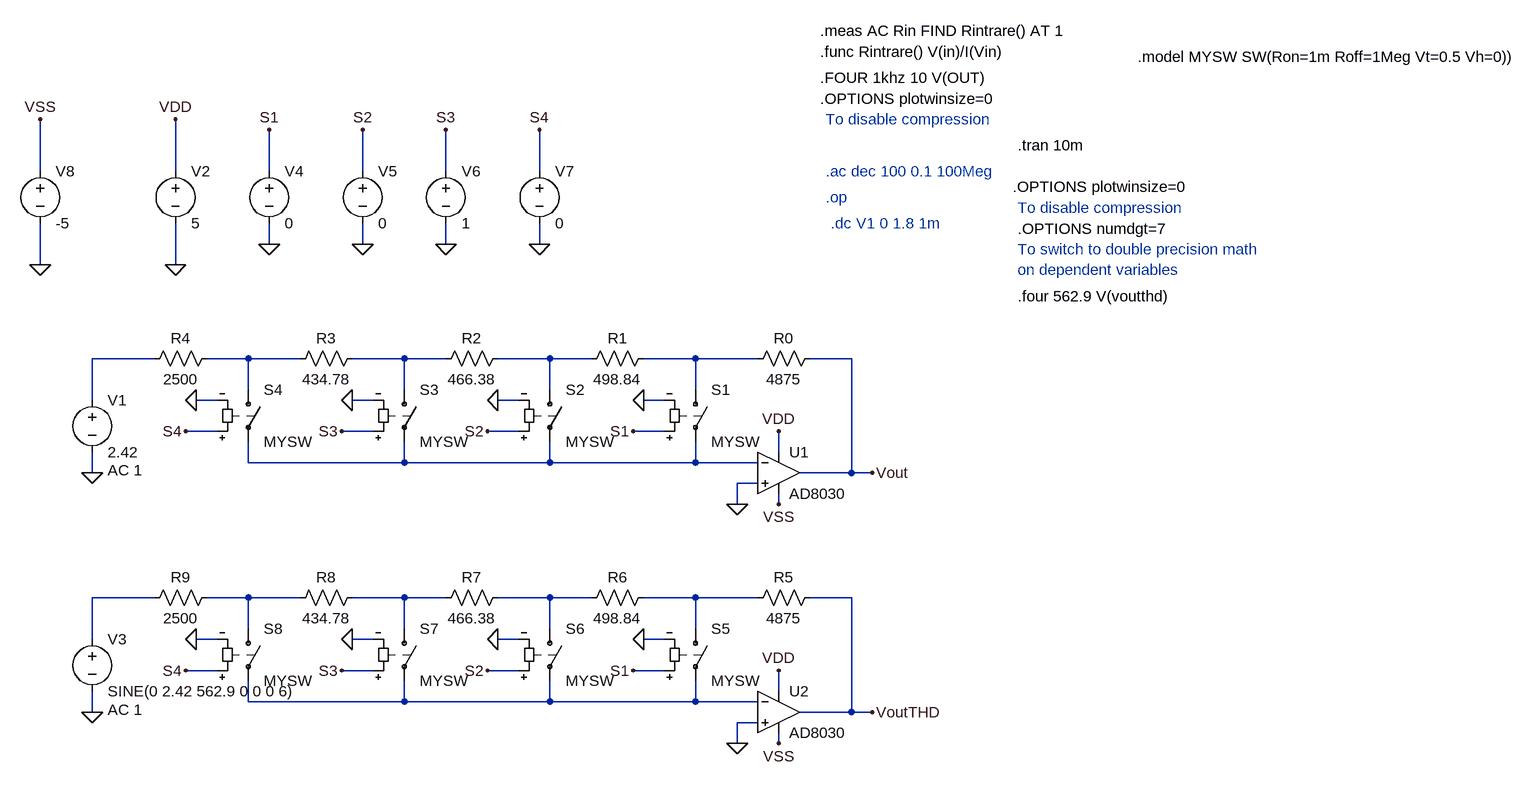
[diagram p0: schematic Stage3.asc]
Stage3.asc, the LTspice schematic file:
Version 4
SHEET 1 1820 2436
WIRE -1360 -240 -1360 -320
WIRE -1152 -240 -1152 -320
WIRE -1008 -240 -1008 -304
WIRE -864 -240 -864 -304
WIRE -736 -240 -736 -304
WIRE -592 -240 -592 -304
WIRE -1008 -128 -1008 -160
WIRE -864 -128 -864 -160
WIRE -736 -128 -736 -160
WIRE -592 -128 -592 -160
WIRE -1360 -96 -1360 -160
WIRE -1152 -96 -1152 -160
WIRE -1184 48 -1280 48
WIRE -1040 48 -1104 48
WIRE -960 48 -1040 48
WIRE -800 48 -880 48
WIRE -736 48 -800 48
WIRE -576 48 -656 48
WIRE -512 48 -576 48
WIRE -352 48 -432 48
WIRE -256 48 -352 48
WIRE -112 48 -176 48
WIRE -1040 96 -1040 48
WIRE -800 96 -800 48
WIRE -576 96 -576 48
WIRE -352 96 -352 48
WIRE -1280 112 -1280 48
WIRE -1088 112 -1120 112
WIRE -848 112 -880 112
WIRE -624 112 -656 112
WIRE -400 112 -432 112
WIRE -1088 160 -1136 160
WIRE -848 160 -896 160
WIRE -624 160 -672 160
WIRE -400 160 -448 160
WIRE -224 192 -224 160
WIRE -1040 208 -1040 176
WIRE -800 208 -800 176
WIRE -800 208 -1040 208
WIRE -576 208 -576 176
WIRE -576 208 -800 208
WIRE -352 208 -352 176
WIRE -352 208 -576 208
WIRE -256 208 -352 208
WIRE -1280 224 -1280 192
WIRE -112 224 -112 48
WIRE -112 224 -192 224
WIRE -80 224 -112 224
WIRE -256 240 -288 240
WIRE -288 272 -288 240
WIRE -224 272 -224 256
WIRE -1184 416 -1280 416
WIRE -1040 416 -1104 416
WIRE -960 416 -1040 416
WIRE -800 416 -880 416
WIRE -736 416 -800 416
WIRE -576 416 -656 416
WIRE -512 416 -576 416
WIRE -352 416 -432 416
WIRE -256 416 -352 416
WIRE -112 416 -176 416
WIRE -1040 464 -1040 416
WIRE -800 464 -800 416
WIRE -576 464 -576 416
WIRE -352 464 -352 416
WIRE -1280 480 -1280 416
WIRE -1088 480 -1120 480
WIRE -848 480 -880 480
WIRE -624 480 -656 480
WIRE -400 480 -432 480
WIRE -1088 528 -1136 528
WIRE -848 528 -896 528
WIRE -624 528 -672 528
WIRE -400 528 -448 528
WIRE -224 560 -224 528
WIRE -1040 576 -1040 544
WIRE -800 576 -800 544
WIRE -800 576 -1040 576
WIRE -576 576 -576 544
WIRE -576 576 -800 576
WIRE -352 576 -352 544
WIRE -352 576 -576 576
WIRE -256 576 -352 576
WIRE -1280 592 -1280 560
WIRE -112 592 -112 416
WIRE -112 592 -192 592
WIRE -80 592 -112 592
WIRE -256 608 -288 608
WIRE -288 640 -288 608
WIRE -224 640 -224 624
FLAG -1152 -96 0
FLAG -1152 -320 VDD
FLAG -1280 224 0
FLAG -1008 -128 0
FLAG -1008 -304 S1
FLAG -864 -128 0
FLAG -864 -304 S2
FLAG -736 -128 0
FLAG -736 -304 S3
FLAG -592 -128 0
FLAG -592 -304 S4
FLAG -224 160 VDD
FLAG -224 272 VSS
FLAG -1360 -96 0
FLAG -1360 -320 VSS
FLAG -448 160 S1
FLAG -672 160 S2
FLAG -656 112 0
FLAG -896 160 S3
FLAG -1136 160 S4
FLAG -288 272 0
FLAG -432 112 0
FLAG -880 112 0
FLAG -1120 112 0
FLAG -80 224 Vout
FLAG -1280 592 0
FLAG -224 528 VDD
FLAG -224 640 VSS
FLAG -448 528 S1
FLAG -672 528 S2
FLAG -656 480 0
FLAG -896 528 S3
FLAG -1136 528 S4
FLAG -288 640 0
FLAG -432 480 0
FLAG -880 480 0
FLAG -1120 480 0
FLAG -80 592 VoutTHD
DATAFLAG -96 224 ""
SYMBOL voltage -1152 -256 R0
WINDOW 123 0 0 Left 2
WINDOW 39 0 0 Left 2
SYMATTR InstName V2
SYMATTR Value 5
SYMBOL voltage -1280 96 R0
WINDOW 123 24 124 Left 2
WINDOW 39 0 0 Left 2
SYMATTR Value2 AC 1
SYMATTR InstName V1
SYMATTR Value 2.42
SYMBOL voltage -1008 -256 R0
WINDOW 123 0 0 Left 2
WINDOW 39 0 0 Left 2
SYMATTR InstName V4
SYMATTR Value 0
SYMBOL voltage -864 -256 R0
WINDOW 123 0 0 Left 2
WINDOW 39 0 0 Left 2
SYMATTR InstName V5
SYMATTR Value 0
SYMBOL voltage -736 -256 R0
WINDOW 123 0 0 Left 2
WINDOW 39 0 0 Left 2
SYMATTR InstName V6
SYMATTR Value 1
SYMBOL voltage -592 -256 R0
WINDOW 123 0 0 Left 2
WINDOW 39 0 0 Left 2
SYMATTR InstName V7
SYMATTR Value 0
SYMBOL res -160 32 R90
WINDOW 0 0 56 VBottom 2
WINDOW 3 32 56 VTop 2
SYMATTR InstName R0
SYMATTR Value 4875
SYMBOL sw -352 80 R0
SYMATTR InstName S1
SYMATTR Value MYSW
SYMBOL sw -576 80 R0
SYMATTR InstName S2
SYMATTR Value MYSW
SYMBOL sw -800 80 R0
SYMATTR InstName S3
SYMATTR Value MYSW
SYMBOL sw -1040 80 R0
SYMATTR InstName S4
SYMATTR Value MYSW
SYMBOL voltage -1360 -256 R0
WINDOW 123 0 0 Left 2
WINDOW 39 0 0 Left 2
SYMATTR InstName V8
SYMATTR Value -5
SYMBOL res -416 32 R90
WINDOW 0 0 56 VBottom 2
WINDOW 3 32 56 VTop 2
SYMATTR InstName R1
SYMATTR Value 498.84
SYMBOL res -640 32 R90
WINDOW 0 0 56 VBottom 2
WINDOW 3 32 56 VTop 2
SYMATTR InstName R2
SYMATTR Value 466.38
SYMBOL res -864 32 R90
WINDOW 0 0 56 VBottom 2
WINDOW 3 32 56 VTop 2
SYMATTR InstName R3
SYMATTR Value 434.78
SYMBOL res -1088 32 R90
WINDOW 0 0 56 VBottom 2
WINDOW 3 32 56 VTop 2
SYMATTR InstName R4
SYMATTR Value 2500
SYMBOL OpAmps\\AD8030 -224 160 R0
SYMATTR InstName U1
SYMBOL voltage -1280 464 R0
WINDOW 123 24 124 Left 2
WINDOW 39 0 0 Left 2
SYMATTR Value2 AC 1
SYMATTR InstName V3
SYMATTR Value SINE(0 2.42 562.9 0 0 0 6)
SYMBOL res -160 400 R90
WINDOW 0 0 56 VBottom 2
WINDOW 3 32 56 VTop 2
SYMATTR InstName R5
SYMATTR Value 4875
SYMBOL sw -352 448 R0
SYMATTR InstName S5
SYMATTR Value MYSW
SYMBOL sw -576 448 R0
SYMATTR InstName S6
SYMATTR Value MYSW
SYMBOL sw -800 448 R0
SYMATTR InstName S7
SYMATTR Value MYSW
SYMBOL sw -1040 448 R0
SYMATTR InstName S8
SYMATTR Value MYSW
SYMBOL res -416 400 R90
WINDOW 0 0 56 VBottom 2
WINDOW 3 32 56 VTop 2
SYMATTR InstName R6
SYMATTR Value 498.84
SYMBOL res -640 400 R90
WINDOW 0 0 56 VBottom 2
WINDOW 3 32 56 VTop 2
SYMATTR InstName R7
SYMATTR Value 466.38
SYMBOL res -864 400 R90
WINDOW 0 0 56 VBottom 2
WINDOW 3 32 56 VTop 2
SYMATTR InstName R8
SYMATTR Value 434.78
SYMBOL res -1088 400 R90
WINDOW 0 0 56 VBottom 2
WINDOW 3 32 56 VTop 2
SYMATTR InstName R9
SYMATTR Value 2500
SYMBOL OpAmps\\AD8030 -224 528 R0
SYMATTR InstName U2
TEXT -152 -240 Left 2 ;.ac dec 100 0.1 100Meg
TEXT -152 -200 Left 2 ;.op
TEXT 144 -280 Left 2 !.tran 10m
TEXT 136 -216 Left 2 !.OPTIONS plotwinsize=0
TEXT 144 -184 Left 2 ;To disable compression
TEXT 144 -152 Left 2 !.OPTIONS numdgt=7
TEXT 144 -120 Left 2 ;To switch to double precision math\non dependent variables
TEXT -160 -456 Left 2 !.meas AC Rin FIND Rintrare() AT 1
TEXT -160 -424 Left 2 !.func Rintrare() V(in)/I(Vin)
TEXT -160 -384 Left 2 !.FOUR 1khz 10 V(OUT)
TEXT -160 -352 Left 2 !.OPTIONS plotwinsize=0
TEXT -152 -320 Left 2 ;To disable compression
TEXT -144 -160 Left 2 ;.dc V1 0 1.8 1m
TEXT 328 -416 Left 2 !.model MYSW SW(Ron=1m Roff=1Meg Vt=0.5 Vh=0))
TEXT 144 -48 Left 2 !.four 562.9 V(voutthd)

The netlist it stands for:
* Stage3.asc
V2 VDD 0 5
V1 N001 0 2.42 AC 1
V4 S1 0 0
V5 S2 0 0
V6 S3 0 1
V7 S4 0 0
R0 Vout N005 4875
S1 N005 N006 S1 0 MYSW
S2 N004 N006 S2 0 MYSW
S3 N003 N006 S3 0 MYSW
S4 N002 N006 S4 0 MYSW
V8 VSS 0 -5
R1 N005 N004 498.84
R2 N004 N003 466.38
R3 N003 N002 434.78
R4 N002 N001 2500
XU1 0 N006 VDD VSS Vout AD8040  ; AD8030, pins In+ In- V+ V- OUT
V3 N007 0 SINE(0 2.42 562.9 0 0 0 6) AC 1
R5 VoutTHD N011 4875
S5 N011 N012 S1 0 MYSW
S6 N010 N012 S2 0 MYSW
S7 N009 N012 S3 0 MYSW
S8 N008 N012 S4 0 MYSW
R6 N011 N010 498.84
R7 N010 N009 466.38
R8 N009 N008 434.78
R9 N008 N007 2500
XU2 0 N012 VDD VSS VoutTHD AD8040  ; AD8030, pins In+ In- V+ V- OUT
* .ac dec 100 0.1 100Meg
* .op
.tran 10m
.OPTIONS plotwinsize=0
* To disable compression
.OPTIONS numdgt=7
* To switch to double precision math
* on dependent variables
.meas AC Rin FIND Rintrare() AT 1
.func Rintrare() V(in)/I(Vin)
.FOUR 1khz 10 V(OUT)
.OPTIONS plotwinsize=0
* To disable compression
* .dc V1 0 1.8 1m
.model MYSW SW(Ron=1m Roff=1Meg Vt=0.5 Vh=0))
.four 562.9 V(voutthd)
.lib ADI.lib
.backanno
.end